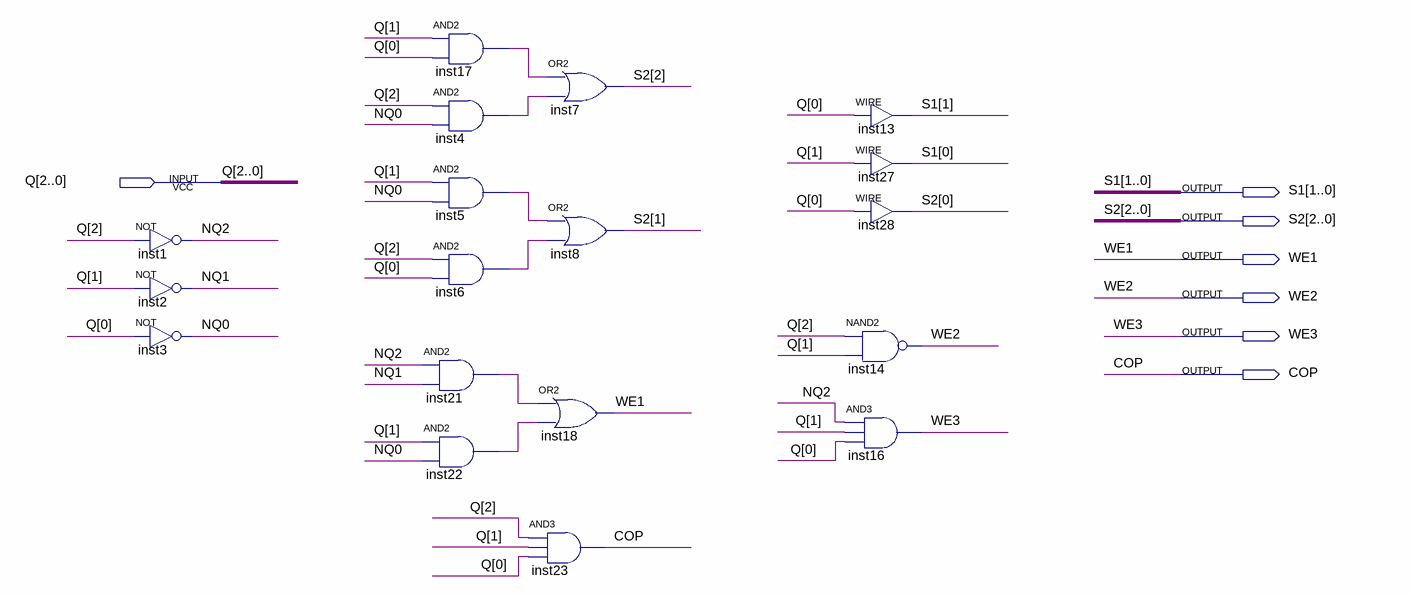
[diagram p0: schematic sheet]
// Quartus schematic OutputBlock.bdf as structural Verilog: 18 symbols, 7 pins
module OutputBlock (
  input  [2:0] Q,
  output [1:0] S1,
  output [2:0] S2,
  output WE1,
  output WE2,
  output WE3,
  output COP
);

  wire inst4_out, inst5_out, inst6_out, inst17_out, inst21_out, inst22_out, NQ0, NQ1, NQ2;

  not inst1 (NQ2, Q[2]);
  not inst2 (NQ1, Q[1]);
  not inst3 (NQ0, Q[0]);
  and inst17 (inst17_out, Q[1], Q[0]);
  and inst4 (inst4_out, Q[2], NQ0);
  and inst5 (inst5_out, Q[1], NQ0);
  and inst6 (inst6_out, Q[2], Q[0]);
  and inst21 (inst21_out, NQ2, NQ1);
  and inst22 (inst22_out, Q[1], NQ0);
  or inst18 (WE1, inst21_out, inst22_out);
  and inst23 (COP, Q[2], Q[1], Q[0]);
  or inst7 (S2[2], inst17_out, inst4_out);
  or inst8 (S2[1], inst5_out, inst6_out);
  nand inst14 (WE2, Q[2], Q[1]);
  and inst16 (WE3, NQ2, Q[1], Q[0]);
  assign S1[1] = Q[0];  // WIRE inst13
  assign S1[0] = Q[1];  // WIRE inst27
  assign S2[0] = Q[0];  // WIRE inst28
endmodule
